# Altium schematic sheet CPUBoard_p3.SchDoc
size A4
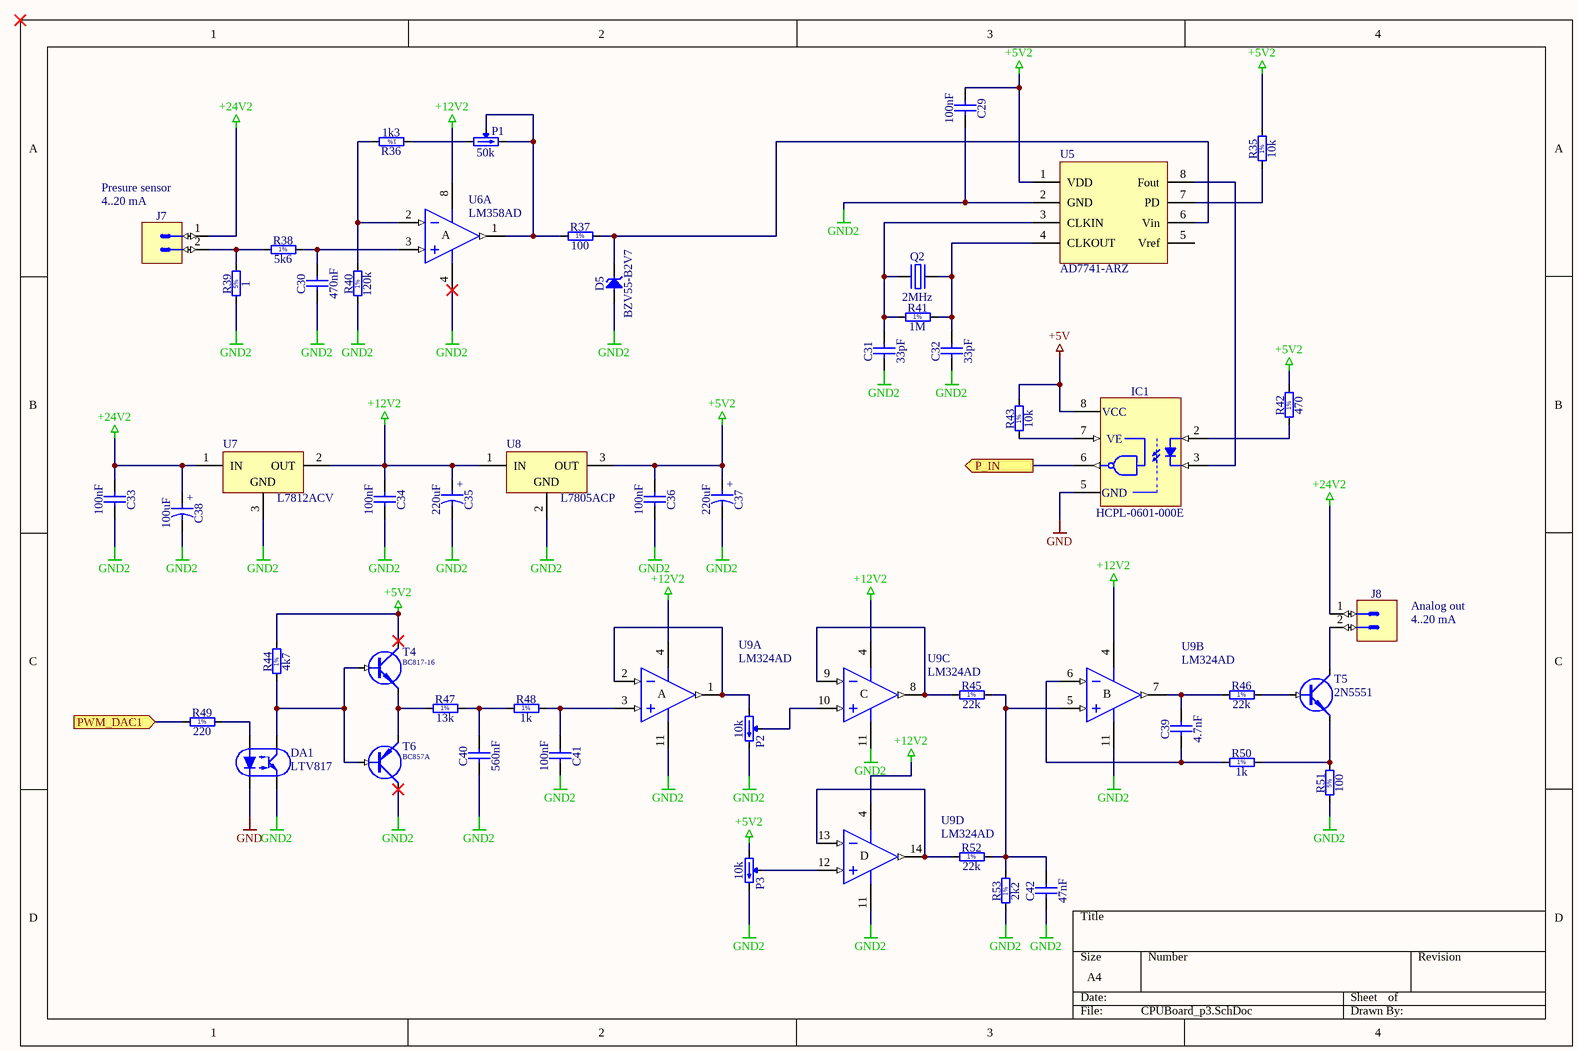
[diagram p0: CPUBoard_p3.SchDoc]

## Parts
C29  100nF  [CAPC2012X135N]
C30  470nF  [CAPC2012X110N]
C31  33pF  [CAPC2012X135N]
C32  33pF  [CAPC2012X135N]
C33  100nF  [CAPC2012X135N]
C34  100nF  [CAPC2012X135N]
C35  220uF  [CAPPR350-850X1300]
C36  100nF  [CAPC2012X135N]
C37  220uF  [CAPPR350-850X1300]
C38  100uF  [CAPPR500-1050X1750]
C39  4.7nF  [CAPC2012X135N]
C40  560nF  [CAPC2012X110N]
C41  100nF  [CAPC2012X135N]
C42  47nF  [CAPC2013X100N]
D5  BZV55-B2V7  [DIOMELF3515N]
DA1  LTV817  [DIL4-300a]
IC1  HCPL-0601-000E  [SOIC127P600X330-8N]
J7  KK®  [MOLEX_22-27-2021]  (value not drawn)
J8  KK®  [MOLEX_22-27-2021]  (value not drawn)
P1  50k  [TRIM_BOURNS_3296Y]
P2  10k  [TRIM_BOURNS_3296Y]
P3  10k  [TRIM_BOURNS_3296Y]
Q2  2MHz  [XTAL_HC-49/U-S]
R35  10k  [RESC2012X60N]
R36  1k3  [RESC2012X60N]
R37  100  [RESC2012X60N]
R38  5k6  [RESC2012X60N]
R39  1  [RESC3225X70N]
R40  120k  [RESC2012X60N]
R41  1M  [RESC2012X60N]
R42  470  [RESC2012X60N]
R43  10k  [RESC2012X60N]
R44  4k7  [RESC2012X60N]
R45  22k  [RESC2012X60N]
R46  22k  [RESC2012X60N]
R47  13k  [RESC2012X60N]
R48  1k  [RESC2012X60N]
R49  220  [RESC2012X60N]
R50  1k  [RESC2012X60N]
R51  100  [RESC3225X70N]
R52  22k  [RESC2012X60N]
R53  2k2  [RESC2012X60N]
T4  BC817-16  [SOT23]
T5  2N5551  [TO92C1]
T6  BC857A  [SOT23]
U5  AD7741-ARZ  [SOIC8 8S1_M]
U6  LM358AD  [SO8_N]  (part A of 2)
U7  L7812ACV  [TO220ABN]
U8  L7805ACP  [TO220FP]
U9  LM324AD  [SO14_N]  (parts A,B,C,D of 4)

## Ports
P_IN (out), PWM_DAC1 (in)

## Nets
+5V: IC1.8(VCC) R43.2
+5V2: C29.1 C36.1 C37.1 P3.1(CCW) R35.2 R42.2 R44.2 T4.3(C) U5.1(VDD) U8.3(OUT)
+12V2: C34.1 C35.1 U6.8(V+) U7.2(OUT) U8.1(IN) U9.4(V+)
+24V2: C33.1 C38.1 J7.1 J8.1 U7.1(IN)
GND: DA1.2(C) IC1.5(GND)
GND2: C29.2 C30.1 C31.1 C32.1 C33.2 C34.2 C35.2 C36.2 C37.2 C38.2 C40.1 C41.2 C42.1 D5.2(A) DA1.3(E) P2.3(CW) P3.3(CW) R39.1 R40.1 R51.1 R53.1 T6.3(C) U5.2(GND) U6.4(V-) U7.3(GND) U8.2(GND) U9.11(V-)
P_IN: IC1.6(VO) ; port P_IN
PWM_DAC1: R49.1 ; port PWM_DAC1
NetC30_2: C30.2 R38.2 U6.3(IN+)
NetC31_2: C31.2 Q2.1(OSC1) R41.1 U5.3(CLKIN)
NetC32_2: C32.2 Q2.2(OSC2) R41.2 U5.4(CLKOUT)
NetC39_1: C39.1 R50.1 U9.6(IN-)
NetC39_2: C39.2 R46.1 U9.7(OUT)
NetC40_2: C40.2 R47.2 R48.1
NetC41_1: C41.1 R48.2 U9.3(IN+)
NetC42_2: C42.2 R45.2 R52.2 R53.2 U9.5(IN+)
NetD5_1: D5.1(C) R37.2 U5.6(Vin)
NetDA1_1: DA1.1(A) R49.2
NetDA1_4: DA1.4(C) R44.1 T4.1(B) T6.1(B)
NetIC1_2: IC1.2(A) R42.1
NetIC1_3: IC1.3(K) U5.8(Fout)
NetIC1_7: IC1.7(VE) R43.1
NetJ7_2: J7.2 R38.1 R39.2
NetJ8_2: J8.2 T5.1(C)
NetP1_1: P1.1(CCW) R36.1
NetP1_2: P1.2(W) P1.3(CW) R37.1 U6.1(OUT)
NetP2_1: P2.1(CCW) U9.1(OUT) U9.2(IN-)
NetP2_2: P2.2(W) U9.10(IN+)
NetP3_2: P3.2(W) U9.12(IN+)
NetR35_1: R35.1 U5.7(PD)
NetR36_2: R36.2 R40.2 U6.2(IN-)
NetR45_1: R45.1 U9.8(OUT) U9.9(IN-)
NetR46_2: R46.2 T5.2(B)
NetR47_1: R47.1 T4.2(E) T6.2(E)
NetR50_2: R50.2 R51.2 T5.3(E)
NetR52_1: R52.1 U9.13(IN-) U9.14(OUT)

Not connected (* = marked no-connect by the designer): U5 5(Vref)

## Notes on the sheet
- (near J7) Presure sensor
- (near J7) 4..20 mA
- Analog out
- 4..20 mA
- (in symbol CAER_100UF_63V_20%_500-1050X1750_LESR0R190) +
- (in symbol CAER_220UF_25V_20%_RUBYCON_25YXF220M8X11.5) +
- (in symbol LM324AD, part A) A
- (in symbol LM324AD, part B) B
- (in symbol LM324AD, part C) C
- (in symbol LM324AD, part D) D
- (in symbol LM358AD, part A) A
- (in symbol R0805_1K3_1%_0.125W_100PPM) 1%
- (in symbol R0805_1K_1%_0.125W_100PPM) 1%
- (in symbol R0805_1M_1%_0.125W_100PPM) 1%
- (in symbol R0805_2K2_1%_0.125W_100PPM) 1%
- (in symbol R0805_4K7_1%_0.125W_100PPM) 1%
- (in symbol R0805_5K6_1%_0.125W_100PPM) 1%
- (in symbol R0805_10K_1%_0.125W_100PPM) 1%
- (in symbol R0805_13K_1%_0.125W_100PPM) 1%
- (in symbol R0805_22K_1%_0.125W_100PPM) 1%
- (in symbol R0805_100R_1%_0.125W_100PPM) 1%
- (in symbol R0805_120K_1%_0.125W_100PPM) 1%
- (in symbol R0805_220R_1%_0.125W_100PPM) 1%
- (in symbol R0805_470R_1%_0.125W_100PPM) 1%
- (in symbol R1210_51R_5%_0.5W_200PPM_PANASONIC_ERJP) 5%
- (in symbol R1210_270R_5%_0.5W_200PPM_PANASONIC_ERJP) 5%

## Library data of the parts
C29 C33 C34 C36 C41 = CC0805_100NF_50V_10%_X7R: Non-polarised capacitor; Part Description: SMD Multilayer Chip Ceramic Capacitor; Manufacturer: GENERIC; Manufacturer1 Part Number: B37941K5104K62; Voltage: 50V; TC: X7R; Tolerance: ±10%; Table: Capacitors SMD; Part Number: CC0805_100NF_50V_10%_X7R; Component Kind: Standard; Component Type: Standard; Pin Count: 2; Value: 100nF; Status: Preferred; Manufacturer Part Number: CC0805_100NF_50V_10%_X7R; Case: 0805; Mounted: Yes; Socket: No; SMD: Yes; Manufacturer1 Example: EPCOS; Manufacturer1 ComponentHeight: 1.35mm; HelpURL: \\cern.ch\dfs\Applications\Altium\Datasheets\CC0805_X7R_EPCOS.pdf; Author: CERN DEM JLC; CreateDate: 03.12.2007; LatestRevisionDate: 03.12.2007
C30 C40 = CC0805_470NF_50V_10%_X7R: Non-polarised capacitor; Part Description: SMD Multilayer Chip Ceramic Capacitor; Manufacturer: GENERIC; Manufacturer1 Part Number: C0805C474K5RACTU; Voltage: 50V; TC: X7R; Tolerance: ±10%; Table: Capacitors SMD; Part Number: CC0805_470NF_50V_10%_X7R; Component Kind: Standard; Component Type: Standard; Pin Count: 2; Status: Preferred; Manufacturer Part Number: CC0805_470NF_50V_10%_X7R; Case: 0805; Mounted: Yes; Socket: No; SMD: Yes; Manufacturer1 Example: KEMET; Manufacturer1 ComponentHeight: 1.1mm; HelpURL: \\cern.ch\dfs\Applications\Altium\Datasheets\CC0805_X7R_KEMET.pdf; Author: CERN DEM JLC; CreateDate: 04.12.2013; LatestRevisionDate: 04.12.2013
  C30: Value: 470nF
  C40: Value: 560nF
C31 C32 = CC0805_33PF_50V_5%_NP0: Non-polarised capacitor; Part Description: SMD Multilayer Chip Ceramic Capacitor; Manufacturer: GENERIC; Manufacturer1 Part Number: 223886115339; Voltage: 50V; TC: NP0; Tolerance: ±5%; Table: Capacitors SMD; Part Number: CC0805_33PF_50V_5%_NP0; Component Kind: Standard; Component Type: Standard; Pin Count: 2; Value: 33pF; Status: Preferred; Manufacturer Part Number: CC0805_33PF_50V_5%_NP0; Case: 0805; Mounted: Yes; Socket: No; SMD: Yes; Manufacturer1 Example: PHYCOMP; Manufacturer1 ComponentHeight: 1.35mm; HelpURL: \\cern.ch\dfs\Applications\Altium\Datasheets\CC0805_NP0_PHYCOMP.pdf; Author: CERN DEM JLC; CreateDate: 03.12.2007; LatestRevisionDate: 03.12.2007
C35 C37 = CAER_220UF_25V_20%_RUBYCON_25YXF220M8X11.5: Polarised capacitor; Part Description: Radial Miniature, Aluminum Electrolytic Capacitor, (YXF Series); Voltage: 25V; Tolerance: ±20%; Table: Capacitors THD; Part Number: CAER_220UF_25V_20%_RUBYCON_25YXF220M8X11.5; Component Kind: Standard; Component Type: Standard; Pin Count: 2; Value: 220uF; Status: None; Manufacturer: RUBYCON; Manufacturer Part Number: 25YXF220M8X11.5; Case: LS3.5 D8.5 x H13; Mounted: Yes; Socket: No; SMD: No; ComponentHeight: 13mm; HelpURL: \\cern.ch\dfs\Applications\Altium\Datasheets\CAER_RUBYCON_YXF.pdf; Author: CERN DEM JLC; CreateDate: 20.08.2009; LatestRevisionDate: 17.09.2009
C38 = CAER_100UF_63V_20%_500-1050X1750_LESR0R190: Polarised capacitor; Part Description: Low ESR 0R190 Aluminum Electrolytic Capacitor; Manufacturer: VISHAY BCCOMPONENTS; Manufacturer Part Number: MAL213668101E3 Series 136RVI; Voltage: 63V; Tolerance: ±20%; Table: Capacitors THD; Part Number: CAER_100UF_63V_20%_500-1050X1750_LESR0R190; Component Kind: Standard; Component Type: Standard; Pin Count: 2; Value: 100uF; Status: Preferred; Case: LS5 D10.5 x H17.5; Mounted: Yes; Socket: No; SMD: No; ComponentHeight: 17.5mm; HelpURL: \\cern.ch\dfs\Applications\Altium\Datasheets\CAER-LESR_VISHAY_136RVI.pdf; Author: CERN DEM JLC; CreateDate: 03.07.2008; LatestRevisionDate: 16.03.2009
C39 = CC0805_4.7NF_50V_10%_X7R: Non-polarised capacitor; Part Description: SMD Multilayer Chip Ceramic Capacitor; Manufacturer: GENERIC; Manufacturer1 Part Number: 223858615632; Voltage: 50V; TC: X7R; Tolerance: ±10%; Table: Capacitors SMD; Part Number: CC0805_4.7NF_50V_10%_X7R; Component Kind: Standard; Component Type: Standard; Pin Count: 2; Value: 4.7nF; Status: Preferred; Manufacturer Part Number: CC0805_4.7NF_50V_10%_X7R; Case: 0805; Mounted: Yes; Socket: No; SMD: Yes; Manufacturer1 Example: PHYCOMP; Manufacturer1 ComponentHeight: 0.94mm; HelpURL: \\cern.ch\dfs\Applications\Altium\Datasheets\CC0805_X7R_PHYCOMP.pdf; Author: CERN DEM JLC; CreateDate: 03.12.2007; LatestRevisionDate: 03.12.2007
C42 = CC0805_47NF_50V_10%_X7R: Non-polarised capacitor; Part Description: SMD Multilayer Chip Ceramic Capacitor; Manufacturer: GENERIC; Manufacturer1 Part Number: C0805F473K5RACTU; Voltage: 50V; TC: X7R; Tolerance: ±10%; Table: Capacitors SMD; Part Number: CC0805_47NF_50V_10%_X7R; Component Kind: Standard; Component Type: Standard; Pin Count: 2; Value: 47nF; Status: Preferred; Manufacturer Part Number: CC0805_47NF_50V_10%_X7R; Case: 0805; Mounted: Yes; Socket: No; SMD: Yes; Manufacturer1 Example: KEMET; Manufacturer1 ComponentHeight: 1mm; HelpURL: \\cern.ch\dfs\Applications\Altium\Datasheets\CC0805_X7R_KEMET.pdf; Author: CERN DEM JLC; CreateDate: 04.12.2013; LatestRevisionDate: 04.12.2013
D5 = BZV55-B2V7: Zener Diode; Part Description: Voltage Regulator Diode; Manufacturer: NXP SEMICONDUCTORS; Voltage: 2V7; Power: 500mW; Table: Diodes; Part Number: BZV55-B2V7; Component Kind: Standard; Component Type: Standard; Device: BZV55-B2V7; PackageDescription: SOD80C, MELF Diode, 2-Leads, Body 3.5x1.5mm, IPC Medium Density; Manufacturer Part Number: BZV55-B2V7; Pin Count: 2; Case: SOD-80C; Mounted: Yes; Socket: No; SMD: Yes; ComponentHeight: 1.6mm; HelpURL: \\cern.ch\dfs\Applications\Altium\Datasheets\BZV55.pdf; Author: CERN DEM JLC; CreateDate: 06.05.2008; LatestRevisionDate: 06.05.2008
IC1 = HCPL-0601-000E: Single Optocoupler; Part Description: High CMR, High Speed TTL Compatible Optocouplers; Manufacturer: AVAGO TECHNOLOGIES; Table: Optocouplers; Part Number: HCPL-0601-000E; Component Kind: Standard; Component Type: Standard; Device: HCPL-0601-000E; PackageDescription: SOIC, 1.27mm pitch;8  pin, 4.00mm W X 5.00mm L, IPC Medium Density; Manufacturer Part Number: HCPL-0601-000E; Pin Count: 8; Case: SOIC8; Mounted: Yes; Socket: No; SMD: Yes; ComponentHeight: 3.3mm; HelpURL: \\cern.ch\dfs\Applications\Altium\Datasheets\HCPL-0601-000E.pdf; Author: CERN DEM JLC; CreateDate: 08.04.2009; LatestRevisionDate: 08.04.2009
J7 J8 = MOLEX_22-27-2021: Connector 2 Male; Part Description: 2.54mm (.100") Pitch KK® Wire-to-Board Header, Vertical, with Friction Lock, 2 Circuits, Tin (Sn) Plating; Manufacturer: MOLEX; Part Number: MOLEX_22-27-2021; Component Kind: Standard; Component Type: Standard; Pin Count: 2; Family: KK®; Mounted: Yes; Socket: No; SMD: No; Status: None; Manufacturer Part Number: 22-27-2021; ComponentHeight: 11.7mm; HelpURL: \\cern.ch\dfs\Applications\Altium\Datasheets\MOLEX_22-27-2021.pdf; Author: CERN DEM JLC; CreateDate: 04.12.2008; LatestRevisionDate: 04.12.2008; Table: MOLEX
P1 = TRIM_25T_50K_BOURNS_3296Y-1-503LF: Trimming Potentiometer; Part Description: 25 Turn Trimming Potentiometer (Top Adjustement); Manufacturer: BOURNS; Power: 0.5W; TC: ±100ppm/°C; Tolerance: ±10%; Table: Potentiometers THD; Part Number: TRIM_25T_50K_BOURNS_3296Y-1-503LF; Component Kind: Standard; Component Type: Standard; Pin Count: 3; Value: 50k; Manufacturer Part Number: 3296Y-1-503LF; Case: 3296Y; Mounted: Yes; Socket: No; SMD: No; ComponentHeight: 11.55mm; HelpURL: \\cern.ch\dfs\Applications\Altium\Datasheets\TRIM_BOURNS_3296Y.pdf; Author: CERN DEM JLC; CreateDate: 20.10.2008; LatestRevisionDate: 28.11.2012
P2 P3 = TRIM_25T_10K_BOURNS_3296Y-1-103LF: Trimming Potentiometer; Part Description: 25 Turn Trimming Potentiometer (Top Adjustement); Manufacturer: BOURNS; Power: 0.5W; TC: ±100ppm/°C; Tolerance: ±10%; Table: Potentiometers THD; Part Number: TRIM_25T_10K_BOURNS_3296Y-1-103LF; Component Kind: Standard; Component Type: Standard; Pin Count: 3; Value: 10k; Manufacturer Part Number: 3296Y-1-103LF; Case: 3296Y; Mounted: Yes; Socket: No; SMD: No; ComponentHeight: 11.55mm; HelpURL: \\cern.ch\dfs\Applications\Altium\Datasheets\TRIM_BOURNS_3296Y.pdf; Author: CERN DEM JLC; CreateDate: 20.10.2008; LatestRevisionDate: 28.11.2012
Q2 = XTAL_5MHZ_CITIZEN_HC49US5.000MABJ-UB: Quartz Crystal; Part Description: Tolerance:± 30ppm, Stability:± 50ppm, -10°C to +60°C, 18pF, Quartz Crystal, HC-49/U-S Serie; Manufacturer: CITIZEN FINETECH MIYOTA CO; Table: Crystals & Oscillators; Part Number: XTAL_5MHZ_CITIZEN_HC49US5.000MABJ-UB; Component Kind: Standard; Component Type: Standard; PackageDescription: HC-49/U-S Leaded Cristal, Body 11.5x4.66mm; Pitch 4.88mm; Value: 2MHz; Manufacturer Part Number: HC49US5.000MABJ-UB; Pin Count: 2; Mounted: Yes; Socket: No; SMD: No; ComponentHeight: 3.5mm; HelpURL: \\cern.ch\dfs\Applications\Altium\Datasheets\XTAL_CITIZEN_HC-49-U-S.pdf; Author: CERN DEM JLC; CreateDate: 27.11.2012; LatestRevisionDate: 27.11.2012
R35 R43 = R0805_10K_1%_0.125W_100PPM: Resistor - 1%; Part Description: General Purpose Thick Film Chip Resistor; Manufacturer: GENERIC; Manufacturer1 Part Number: NRC10F1002TRF; Power: 0.125W; TC: ±100ppm/°C; Table: Resistors SMD; Part Number: R0805_10K_1%_0.125W_100PPM; Component Kind: Standard; Component Type: Standard; Pin Count: 2; Value: 10k; Status: Preferred; Tolerance: ±1%; Manufacturer Part Number: R0805_10K_1%_0.125W_100PPM; Case: 0805; Mounted: Yes; Socket: No; SMD: Yes; Manufacturer1 Example: NIC COMPONENT; Manufacturer1 ComponentHeight: 0.6mm; HelpURL: \\cern.ch\dfs\Applications\Altium\Datasheets\R0805_NIC_NRC.pdf; Author: CERN DEM JLC; CreateDate: 03.12.2007; LatestRevisionDate: 13.03.2008
R36 = R0805_1K3_1%_0.125W_100PPM: Resistor - 1%; Part Description: General Purpose Thick Film Chip Resistor; Manufacturer: GENERIC; Manufacturer1 Part Number: NRC10F1301TRF; Power: 0.125W; TC: ±100ppm/°C; Table: Resistors SMD; Part Number: R0805_1K3_1%_0.125W_100PPM; Component Kind: Standard; Component Type: Standard; Pin Count: 2; Value: 1k3; Status: Preferred; Tolerance: ±1%; Manufacturer Part Number: R0805_1K3_1%_0.125W_100PPM; Case: 0805; Mounted: Yes; Socket: No; SMD: Yes; Manufacturer1 Example: NIC COMPONENT; Manufacturer1 ComponentHeight: 0.6mm; HelpURL: \\cern.ch\dfs\Applications\Altium\Datasheets\R0805_NIC_NRC.pdf; Author: CERN DEM JLC; CreateDate: 03.12.2007; LatestRevisionDate: 13.03.2008
R37 = R0805_100R_1%_0.125W_100PPM: Resistor - 1%; Part Description: General Purpose Thick Film Chip Resistor; Manufacturer: GENERIC; Manufacturer1 Part Number: NRC10F4700TRF; Power: 0.125W; TC: ±100ppm/°C; Table: Resistors SMD; Part Number: R0805_100R_1%_0.125W_100PPM; Component Kind: Standard; Component Type: Standard; Pin Count: 2; Value: 100; Status: Preferred; Tolerance: ±1%; Manufacturer Part Number: R0805_100R_1%_0.125W_100PPM; Case: 0805; Mounted: Yes; Socket: No; SMD: Yes; Manufacturer1 Example: NIC COMPONENT; Manufacturer1 ComponentHeight: 0.6mm; HelpURL: \\cern.ch\dfs\Applications\Altium\Datasheets\R0805_NIC_NRC.pdf; Author: CERN DEM JLC; CreateDate: 03.12.2007; LatestRevisionDate: 13.03.2008
R38 = R0805_5K6_1%_0.125W_100PPM: Resistor - 1%; Part Description: General Purpose Thick Film Chip Resistor; Manufacturer: GENERIC; Manufacturer1 Part Number: NRC10F5601TRF; Power: 0.125W; TC: ±100ppm/°C; Table: Resistors SMD; Part Number: R0805_5K6_1%_0.125W_100PPM; Component Kind: Standard; Component Type: Standard; Pin Count: 2; Value: 5k6; Status: Preferred; Tolerance: ±1%; Manufacturer Part Number: R0805_5K6_1%_0.125W_100PPM; Case: 0805; Mounted: Yes; Socket: No; SMD: Yes; Manufacturer1 Example: NIC COMPONENT; Manufacturer1 ComponentHeight: 0.6mm; HelpURL: \\cern.ch\dfs\Applications\Altium\Datasheets\R0805_NIC_NRC.pdf; Author: CERN DEM JLC; CreateDate: 03.12.2007; LatestRevisionDate: 13.03.2008
R39 = R1210_51R_5%_0.5W_200PPM_PANASONIC_ERJP: Resistor - 0,1%; Part Description: Anti-Surge Thick Film Chip Resistor; Manufacturer Part Number: ERJP14J510U; Power: 0.5W; TC: ±200ppm/°C; Tolerance: ±0.1%; Table: Resistors SMD; Part Number: R1210_51R_5%_0.5W_200PPM_PANASONIC_ERJP; Component Kind: Standard; Component Type: Standard; Pin Count: 2; Value: 1; Status: None; Manufacturer: PANASONIC; Case: 1210; Mounted: Yes; Socket: No; SMD: Yes; ComponentHeight: 0.7mm; HelpURL: \\cern.ch\dfs\Applications\Altium\Datasheets\R1210_PANASONIC_ERJP14.pdf; Author: CERN DEM JLC; CreateDate: 21.01.2013; LatestRevisionDate: 28.11.2012
R40 = R0805_120K_1%_0.125W_100PPM: Resistor - 1%; Part Description: General Purpose Thick Film Chip Resistor; Manufacturer: GENERIC; Manufacturer1 Part Number: NRC10F1203TRF; Power: 0.125W; TC: ±100ppm/°C; Table: Resistors SMD; Part Number: R0805_120K_1%_0.125W_100PPM; Component Kind: Standard; Component Type: Standard; Pin Count: 2; Value: 120k; Status: Preferred; Tolerance: ±1%; Manufacturer Part Number: R0805_120K_1%_0.125W_100PPM; Case: 0805; Mounted: Yes; Socket: No; SMD: Yes; Manufacturer1 Example: NIC COMPONENT; Manufacturer1 ComponentHeight: 0.6mm; HelpURL: \\cern.ch\dfs\Applications\Altium\Datasheets\R0805_NIC_NRC.pdf; Author: CERN DEM JLC; CreateDate: 03.12.2007; LatestRevisionDate: 13.03.2008
R41 = R0805_1M_1%_0.125W_100PPM: Resistor - 1%; Part Description: General Purpose Thick Film Chip Resistor; Manufacturer: GENERIC; Manufacturer1 Part Number: NRC10F1004TRF; Power: 0.125W; TC: ±100ppm/°C; Table: Resistors SMD; Part Number: R0805_1M_1%_0.125W_100PPM; Component Kind: Standard; Component Type: Standard; Pin Count: 2; Value: 1M; Status: Preferred; Tolerance: ±1%; Manufacturer Part Number: R0805_1M_1%_0.125W_100PPM; Case: 0805; Mounted: Yes; Socket: No; SMD: Yes; Manufacturer1 Example: NIC COMPONENT; Manufacturer1 ComponentHeight: 0.6mm; HelpURL: \\cern.ch\dfs\Applications\Altium\Datasheets\R0805_NIC_NRC.pdf; Author: CERN DEM JLC; CreateDate: 03.12.2007; LatestRevisionDate: 13.03.2008
R42 = R0805_470R_1%_0.125W_100PPM: Resistor - 1%; Part Description: General Purpose Thick Film Chip Resistor; Manufacturer: GENERIC; Manufacturer1 Part Number: NRC10F4700TRF; Power: 0.125W; TC: ±100ppm/°C; Table: Resistors SMD; Part Number: R0805_470R_1%_0.125W_100PPM; Component Kind: Standard; Component Type: Standard; Pin Count: 2; Value: 470; Status: Preferred; Tolerance: ±1%; Manufacturer Part Number: R0805_470R_1%_0.125W_100PPM; Case: 0805; Mounted: Yes; Socket: No; SMD: Yes; Manufacturer1 Example: NIC COMPONENT; Manufacturer1 ComponentHeight: 0.6mm; HelpURL: \\cern.ch\dfs\Applications\Altium\Datasheets\R0805_NIC_NRC.pdf; Author: CERN DEM JLC; CreateDate: 03.12.2007; LatestRevisionDate: 13.03.2008
R44 = R0805_4K7_1%_0.125W_100PPM: Resistor - 1%; Part Description: General Purpose Thick Film Chip Resistor; Manufacturer: GENERIC; Manufacturer1 Part Number: NRC10F4701TRF; Power: 0.125W; TC: ±100ppm/°C; Table: Resistors SMD; Part Number: R0805_4K7_1%_0.125W_100PPM; Component Kind: Standard; Component Type: Standard; Pin Count: 2; Value: 4k7; Status: Preferred; Tolerance: ±1%; Manufacturer Part Number: R0805_4K7_1%_0.125W_100PPM; Case: 0805; Mounted: Yes; Socket: No; SMD: Yes; Manufacturer1 Example: NIC COMPONENT; Manufacturer1 ComponentHeight: 0.6mm; HelpURL: \\cern.ch\dfs\Applications\Altium\Datasheets\R0805_NIC_NRC.pdf; Author: CERN DEM JLC; CreateDate: 03.12.2007; LatestRevisionDate: 13.03.2008
R45 R46 R52 = R0805_22K_1%_0.125W_100PPM: Resistor - 1%; Part Description: General Purpose Thick Film Chip Resistor; Manufacturer: GENERIC; Manufacturer1 Part Number: NRC10F2202TRF; Power: 0.125W; TC: ±100ppm/°C; Table: Resistors SMD; Part Number: R0805_22K_1%_0.125W_100PPM; Component Kind: Standard; Component Type: Standard; Pin Count: 2; Value: 22k; Status: Preferred; Tolerance: ±1%; Manufacturer Part Number: R0805_22K_1%_0.125W_100PPM; Case: 0805; Mounted: Yes; Socket: No; SMD: Yes; Manufacturer1 Example: NIC COMPONENT; Manufacturer1 ComponentHeight: 0.6mm; HelpURL: \\cern.ch\dfs\Applications\Altium\Datasheets\R0805_NIC_NRC.pdf; Author: CERN DEM JLC; CreateDate: 03.12.2007; LatestRevisionDate: 13.03.2008
R47 = R0805_13K_1%_0.125W_100PPM: Resistor - 1%; Part Description: General Purpose Thick Film Chip Resistor; Manufacturer: GENERIC; Manufacturer1 Part Number: NRC10F1302TRF; Power: 0.125W; TC: ±100ppm/°C; Table: Resistors SMD; Part Number: R0805_13K_1%_0.125W_100PPM; Component Kind: Standard; Component Type: Standard; Pin Count: 2; Value: 13k; Status: Preferred; Tolerance: ±1%; Manufacturer Part Number: R0805_13K_1%_0.125W_100PPM; Case: 0805; Mounted: Yes; Socket: No; SMD: Yes; Manufacturer1 Example: NIC COMPONENT; Manufacturer1 ComponentHeight: 0.6mm; HelpURL: \\cern.ch\dfs\Applications\Altium\Datasheets\R0805_NIC_NRC.pdf; Author: CERN DEM JLC; CreateDate: 03.12.2007; LatestRevisionDate: 13.03.2008
R48 R50 = R0805_1K_1%_0.125W_100PPM: Resistor - 1%; Part Description: General Purpose Thick Film Chip Resistor; Manufacturer: GENERIC; Manufacturer1 Part Number: NRC10F1001TRF; Power: 0.125W; TC: ±100ppm/°C; Table: Resistors SMD; Part Number: R0805_1K_1%_0.125W_100PPM; Component Kind: Standard; Component Type: Standard; Pin Count: 2; Value: 1k; Status: Preferred; Tolerance: ±1%; Manufacturer Part Number: R0805_1K_1%_0.125W_100PPM; Case: 0805; Mounted: Yes; Socket: No; SMD: Yes; Manufacturer1 Example: NIC COMPONENT; Manufacturer1 ComponentHeight: 0.6mm; HelpURL: \\cern.ch\dfs\Applications\Altium\Datasheets\R0805_NIC_NRC.pdf; Author: CERN DEM JLC; CreateDate: 03.12.2007; LatestRevisionDate: 13.03.2008
R49 = R0805_220R_1%_0.125W_100PPM: Resistor - 1%; Part Description: General Purpose Thick Film Chip Resistor; Manufacturer: GENERIC; Manufacturer1 Part Number: NRC10F2200TRF; Power: 0.125W; TC: ±100ppm/°C; Table: Resistors SMD; Part Number: R0805_220R_1%_0.125W_100PPM; Component Kind: Standard; Component Type: Standard; Pin Count: 2; Value: 220; Status: Preferred; Tolerance: ±1%; Manufacturer Part Number: R0805_220R_1%_0.125W_100PPM; Case: 0805; Mounted: Yes; Socket: No; SMD: Yes; Manufacturer1 Example: NIC COMPONENT; Manufacturer1 ComponentHeight: 0.6mm; HelpURL: \\cern.ch\dfs\Applications\Altium\Datasheets\R0805_NIC_NRC.pdf; Author: CERN DEM JLC; CreateDate: 03.12.2007; LatestRevisionDate: 13.03.2008
R51 = R1210_270R_5%_0.5W_200PPM_PANASONIC_ERJP: Resistor - 0.1%; Part Number: R1210_100R_5%_0.5W_200PPM_PANASONIC_ERJP; Part Description: Anti-Surge Thick Film Chip Resistor; Manufacturer Part Number: ERJP14J271U; Power: 0.5W; TC: ±200ppm/°C; Table: Resistors SMD; Component Kind: Standard; Component Type: Standard; Pin Count: 2; Value: 100; Status: None; Tolerance: ±0.1%; Manufacturer: PANASONIC; Case: 1210; Mounted: Yes; Socket: No; SMD: Yes; ComponentHeight: 0.7mm; HelpURL: \\cern.ch\dfs\Applications\Altium\Datasheets\R1210_PANASONIC_ERJP14.pdf; Author: CERN DEM JLC; CreateDate: 21.01.2013; LatestRevisionDate: 26.10.2011
R53 = R0805_2K2_1%_0.125W_100PPM: Resistor - 1%; Part Description: General Purpose Thick Film Chip Resistor; Manufacturer: GENERIC; Manufacturer1 Part Number: NRC10F2201TRF; Power: 0.125W; TC: ±100ppm/°C; Table: Resistors SMD; Part Number: R0805_2K2_1%_0.125W_100PPM; Component Kind: Standard; Component Type: Standard; Pin Count: 2; Value: 2k2; Status: Preferred; Tolerance: ±1%; Manufacturer Part Number: R0805_2K2_1%_0.125W_100PPM; Case: 0805; Mounted: Yes; Socket: No; SMD: Yes; Manufacturer1 Example: NIC COMPONENT; Manufacturer1 ComponentHeight: 0.6mm; HelpURL: \\cern.ch\dfs\Applications\Altium\Datasheets\R0805_NIC_NRC.pdf; Author: CERN DEM JLC; CreateDate: 03.12.2007; LatestRevisionDate: 13.03.2008
T4 = BC817-16: SMD-SOT23; Price: 0.031
T5 = 2N5551: 150V 0.5A 100MHz 6p (10V); Price: 0.083
T6 = BC857A: SMD-SOT23; Price: 0.04
U6 = LM358AD: Low-Power Dual Operational Amplifier; Published: 24-Aug-2001; LatestRevisionDate: 13-Apr-2006; LatestRevisionNote: IPC-7351 Footprint Added.; DatasheetVersion: Jun-1998; PackageVersion: Dec-2002; PackageReference: SO8; Publisher: Altium Limited; PackageDescription: 8-Pin Small Outline Integrated Circuit 1.27 mm Pitch; Code_JEDEC: MS-012-AA; Code_IPC: SOIC127P600-8; ComponentLink1Description: Manufacturer Link; ComponentLink1URL: http://www.st.com/; ComponentLink2Description: Datasheet; ComponentLink2URL: http://www.st.com/stonline/products/literature/ds/2163/lm358.pdf
U7 = L7812ACV: Precision 1A Regulator; Published: 24-Aug-2001; LatestRevisionDate: 17-Jul-2002; LatestRevisionNote: Re-released for DXP Platform.; DatasheetVersion: Nov-1999; PackageVersion: Jun-1998; PackageReference: TO220ABN; Publisher: Altium Limited; PackageDescription: TO, Thru-Hole, Vertical, Heatsink Mounted; 3 In-Line Leads; Pitch 2.54 mm; Pin sequence 1, 3, 2; ComponentLink1Description: Manufacturer Link; ComponentLink1URL: http://www.st.com/; ComponentLink2Description: Datasheet; ComponentLink2URL: http://www.st.com/stonline/products/literature/ds/2144/l7805ab.pdf
U8 = L7805ACP: Positive Voltage Regulator, 5V, 3-Pin TO-220FP; DatasheetVersion: Nov-2011; PackageVersion: 2011; PackageReference: TO220FP; PackageDescription: TO, Thru-Hole, Vertical, Heatsink Mounted; 3 In-Line Leads; Pitch 2.54 mm; PartNumber: L7805ACP; ComponentLink1Description: Manufacturer URL; ComponentLink1URL: http://www.st.com; ComponentLink2Description: Datasheet; ComponentLink2URL: http://www.st.com/internet/com/TECHNICAL_RESOURCES/TECHNICAL_LITERATURE/DATASHEET/CD00000444.pdf
U9 = LM324AD: Low-Power Quad Operational Amplifier; Published: 24-Aug-2001; LatestRevisionDate: 13-Apr-2006; LatestRevisionNote: IPC-7351 Footprint Added.; DatasheetVersion: Nov-1997; PackageVersion: Sep-1998; PackageReference: SO14; Publisher: Altium Limited; PackageDescription: 14-Pin Small Outline Integrated Circuit 1.27 mm Pitch; Code_IPC: SOIC127P600-14; ComponentLink1Description: Manufacturer Link; ComponentLink1URL: http://www.st.com/; ComponentLink2Description: Datasheet; ComponentLink2URL: http://www.st.com/stonline/products/literature/ds/4797/lm224a.pdf
DA1 = LTV817: Price: 0.28